# EAGLE design feedback-strobe (EAGLE 7.3.0)
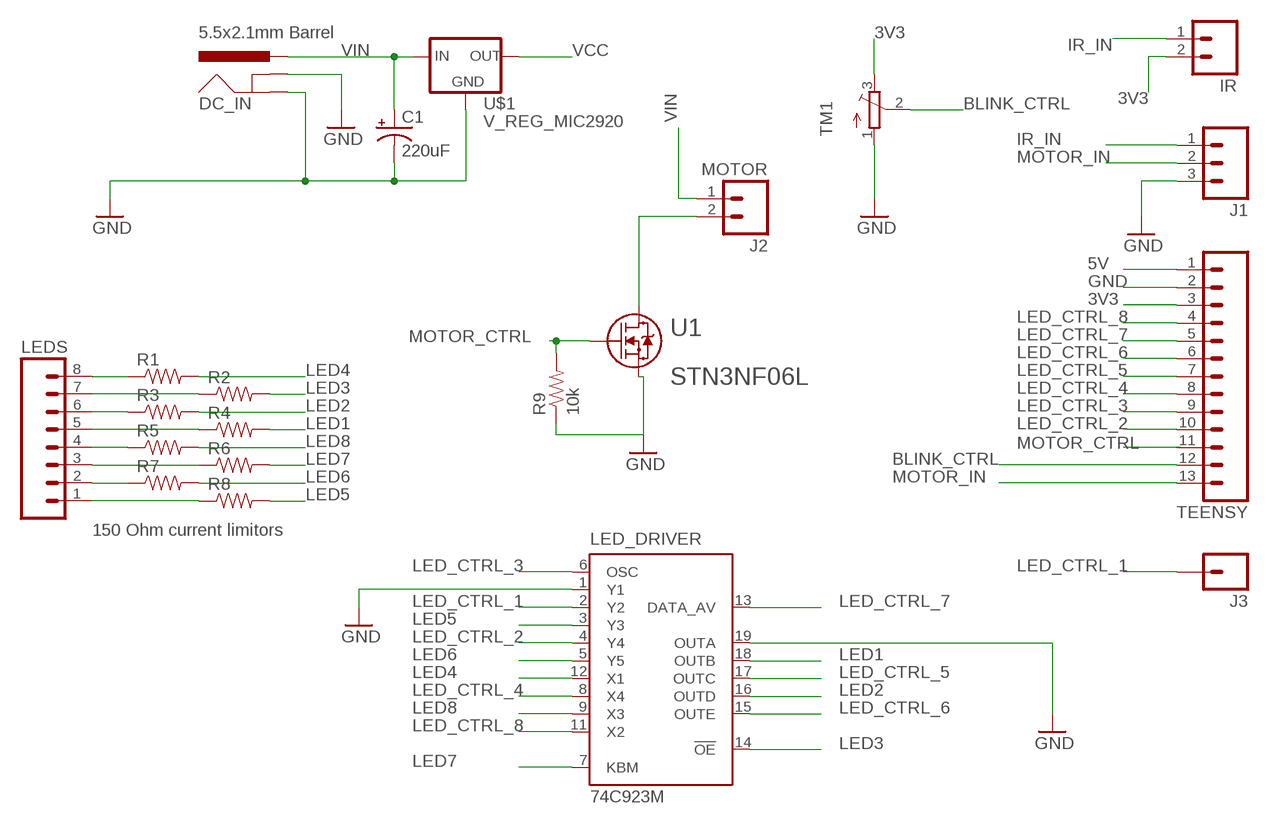
[diagram p0: schematic, sheet 1]

## Parts
C1  220uF  CAP_POLF80  [NIPPON_F80]
DC_IN  5.5x2.1mm Barrel  POWER_JACKSMD  [POWER_JACK_SMD]
IR  M02PTH  [1X02]
J1  M03PTH  [1X03]
J2  MOTOR  M02PTH  [1X02]
J3  M01PTH  [1X01]
LED_DRIVER  74C923M  [SO20W]
LEDS  M08  [1X08_ROUND]
R1  RESISTOR0603-RES  [0603-RES]
R2  RESISTOR0603-RES  [0603-RES]
R3  RESISTOR0603-RES  [0603-RES]
R4  RESISTOR0603-RES  [0603-RES]
R5  RESISTOR0603-RES  [0603-RES]
R6  RESISTOR0603-RES  [0603-RES]
R7  RESISTOR0603-RES  [0603-RES]
R8  RESISTOR0603-RES  [0603-RES]
R9  10k  RESISTOR0603-RES  [0603-RES]
TEENSY  M13  [1X13]
TM1  TRIMPOT3386  [TRIM-3386]
U1  STN3NF06L  [SOT-223]
U$1  V_REG_MIC2920  [SOT223]

## Nets
3V3: IR.2 TEENSY.3 TM1.3(E)
5V: TEENSY.1
BLINK_CTRL: TEENSY.12 TM1.2(S)
GND: C1.- DC_IN.GND(GNDBREAK) DC_IN.P$4(GND) J1.3 LED_DRIVER.1(Y1) LED_DRIVER.19(OUTA) R9.1 TEENSY.2 TM1.1(A) U1.3 U$1.2(GND)
IR_IN: IR.1 J1.1
LED1: LED_DRIVER.18(OUTB) R4.2
LED2: LED_DRIVER.16(OUTD) R3.2
LED3: LED_DRIVER.14(!OE) R2.2
LED4: LED_DRIVER.12(X1) R1.2
LED5: LED_DRIVER.3(Y3) R8.2
LED6: LED_DRIVER.5(Y5) R7.2
LED7: LED_DRIVER.7(KBM) R6.2
LED8: LED_DRIVER.9(X3) R5.2
LED_CTRL_1: J3.1 LED_DRIVER.2(Y2)
LED_CTRL_2: LED_DRIVER.4(Y4) TEENSY.10
LED_CTRL_3: LED_DRIVER.6(OSC) TEENSY.9
LED_CTRL_4: LED_DRIVER.8(X4) TEENSY.8
LED_CTRL_5: LED_DRIVER.17(OUTC) TEENSY.7
LED_CTRL_6: LED_DRIVER.15(OUTE) TEENSY.6
LED_CTRL_7: LED_DRIVER.13(DATA_AV) TEENSY.5
LED_CTRL_8: LED_DRIVER.11(X2) TEENSY.4
MOTOR_CTRL: R9.2 U1.1
MOTOR_IN: J1.2 TEENSY.13
N$1: LEDS.8 R1.1
N$3: LEDS.7 R2.1
N$5: LEDS.6 R3.1
N$7: J2.2 U1.2
N$12: LEDS.1 R8.1
N$13: LEDS.2 R7.1
N$16: LEDS.4 R5.1
N$17: LEDS.3 R6.1
N$18: LEDS.5 R4.1
VCC: U$1.3(OUT)
VIN: C1.+ DC_IN.VIN0(PWR) J2.1 U$1.1(IN)
Unconnected: TEENSY.11

## Notes on the sheet
- 150 Ohm current limitors

## Power pins joined to a net without a drawn wire
GND: LED_DRIVER.10(GND)
VCC: LED_DRIVER.20(VCC)

## Library data of the parts
C1 = SparkFun-Passives:CAP_POL: Capacitor Polarized These are standard SMD and PTH capacitors. Normally 10uF, 47uF, and 100uF in electrolytic and tantalum varieties. Always verify the external diameter of the through hole cap, it varies with capacity, voltage, and manufacturer. The EIA devices should be standard.
DC_IN = SparkFun-Connectors:POWER_JACK: Power Jack This is the standard 5.5mm barrel jack for power. The PTH is the most common, proven, reliable, footprint. The Slot footprint only works if the mill layer is transmitted to the PCB fab house so be warned. Mating wall wart : TOL-00298 (and others); PROD_ID: CONN-08106; SF_ID: PRT-12748
IR J2 = SparkFun-Connectors:M02: Standard 2-pin 0.1" header. Use with - straight break away headers ( PRT-00116) - right angle break away headers (PRT-00553) - swiss pins (PRT-00743) - machine pins (PRT-00117) - female headers (PRT-00115) Molex polarized connector foot print use with: PRT-08233 with associated crimp pins and housings. 2.54_SCREWTERM for use with PRT-10571. 3.5mm Screw Terminal footprints for PRT-08084 5mm Screw Terminal footprints for use with PRT-08432
J1 = SparkFun-Connectors:M03: Header 3 Standard 3-pin 0.1" header. Use with straight break away headers (SKU : PRT-00116), right angle break away headers (PRT-00553), swiss pins (PRT-00743), machine pins (PRT-00117), and female headers (PRT-00115). Molex polarized connector foot print use with SKU : PRT-08232 with associated crimp pins and housings.
J3 = SparkFun-Connectors:M01: Header 1 Standard 1-pin 0.1" header. Use with straight break away headers (SKU : PRT-00116), right angle break away headers (PRT-00553), swiss pins (PRT-00743), machine pins (PRT-00117), and female headers (PRT-00115). SMTSO-256-ET is a "flush mount" nut for a 4-40 screw. The older package used to be too tight, and did not allow it to sit properly thru the drill hit. The latest (0.165DIA) fits nice and snug.
LED_DRIVER = 74xx-us:74C923: 20-Key Encoder Source: http://www.national.com/ds/MM/MM54C922.pdf#page=1
LEDS = SparkFun-Connectors:M08: Header 8 Standard 8-pin 0.1" header. Use with straight break away headers (SKU : PRT-00116), right angle break away headers (PRT-00553), swiss pins (PRT-00743), machine pins (PRT-00117), and female headers (PRT-00115).; PROD_ID: CONN-08437
R1-R9 = SparkFun-Passives:RESISTOR: Resistor Basic schematic elements and footprints for 0603, 1206, and PTH resistors.
TEENSY = SparkFun-Connectors:M13: 13-pin single row .1" header
TM1 = adafruit:TRIMPOT: SMT trimmer potentiometer part number TC33X http://www.ladyada.net/library/eagle
U1 = n-fet:STN3NF06L; COPYRIGHT: Copyright C 2015 Accelerated Designs. All rights reserved; CURRENTCONTINUOUSDRAINID25C: 4A; DATASHEET: httpwww.st.cominternetcomTECHNICAL_RESOURCESTECHNICAL_LITERATUREDATASHEETCD00002430.pdf; DIGIKEYPARTNUMBER: 49731772ND; DRAINTOSOURCEVOLTAGEVDSS: 60V; FETFEATURE: Logic Level Gate; FETTYPE: MOSFET NChannel Metal Oxide; GATECHARGEQGVGS: 9nC 5V; INPUTCAPACITANCECISSVDS: 340pF 25V; MANUFACTURER_PART_NUMBER: STN3NF06L; MOUNTINGTYPE: Surface Mount; PACKAGECASE: TO2614 TO261AA; PACKAGING: Tape &amp Reel TR; POWERMAX: 3.3W; QUANTITY_AVAILABLE: 16000; RDSONMAXIDVGS: 100 mOhm 1.5A 10V; SUPPLIERDEVICEPACKAGE: SOT223; VENDOR: ST Microelectronics; VGSTHMAXID: 2.8V 250µA
U$1 = SparkFun-PowerIC:V_REG_MIC2920: MIC2920A (http://www.micrel.com/_PDF/mic2920.pdf) - 400mA output LDO Regulator

## Board
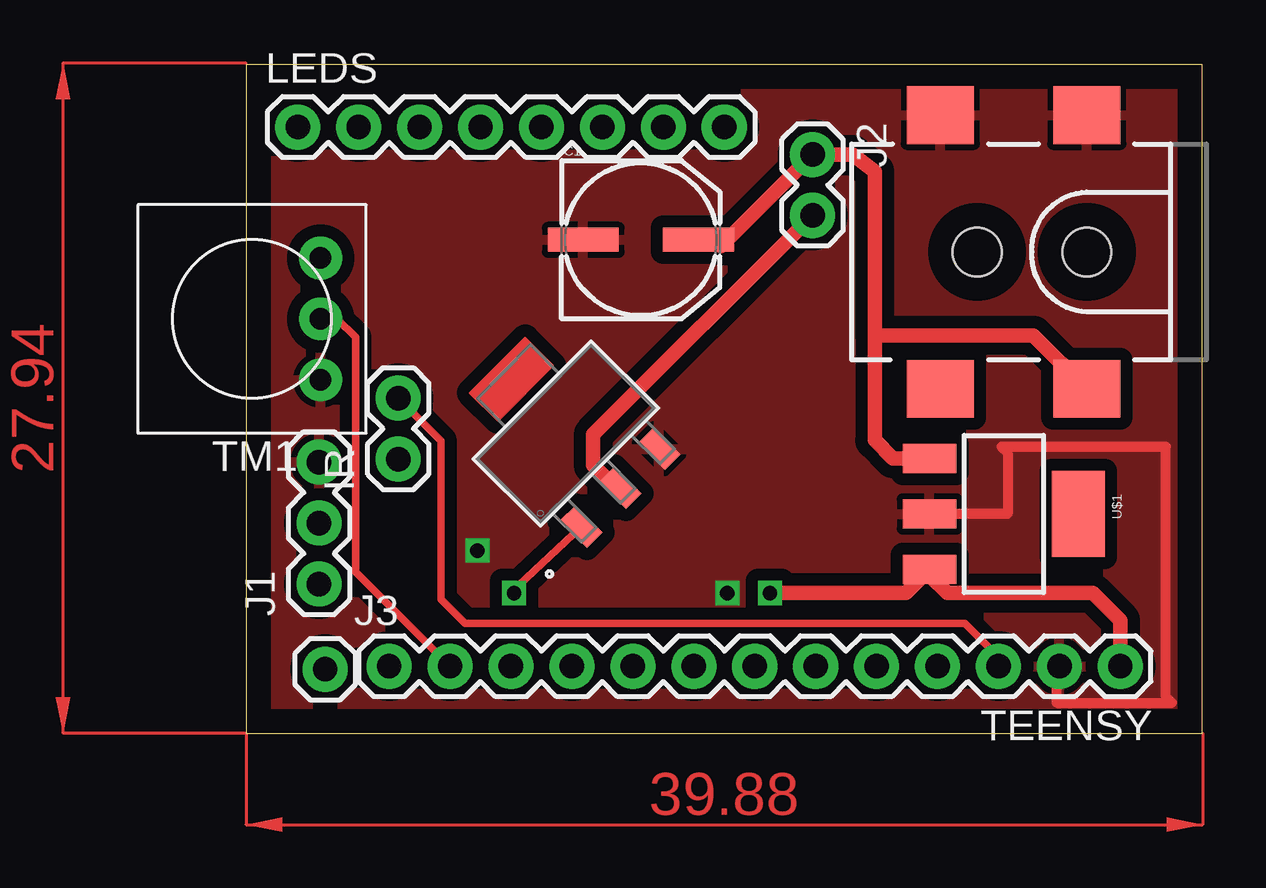
[diagram p1: board, top side]
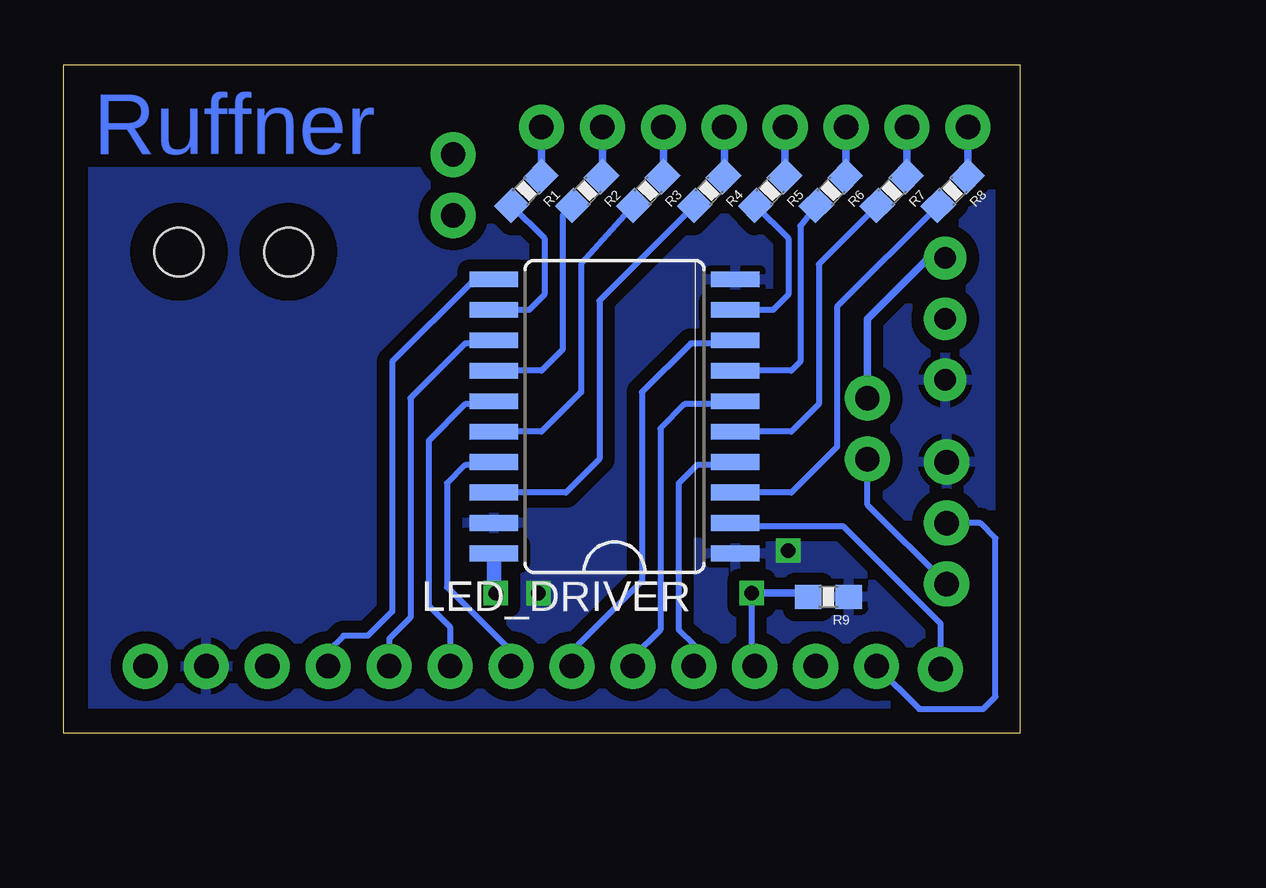
[diagram p2: board, bottom side, seen from below]

Size 39.86 x 27.86 mm. Coordinates in mm from the lower left corner, seen from the top.
Outline: 0,0 39.86,0 39.86,27.86 0,27.86 0,0
Copper layers (1*16): Top 0.035mm / dielectric 1.5mm / Bottom 0.035mm
Design rules "default": minimum track width 10mil, minimum drill 24mil, track to track 8mil, track to pad 8mil, pad to pad 8mil, via to via 8mil, smd to smd 8mil, copper to edge 40mil, drill to drill 8mil, minimum pad ring 10mil, minimum via ring 8mil, stop-mask expansion 4mil, vias tented up to drill 0mil, thermal gap 10mil

### Footprints (pad centres in the part's own frame; a part is rotated, then mirrored left to right if it is on the bottom)
NIPPON_F80 = smd 2.95 x 1: + 2.4,0; - -2.4,0
POWER_JACK_SMD = smd 2.8 x 2.4: GND 0,-5.7; P$4 6.1,-5.7; VIN0 0,5.7; VIN1 6.1,5.7 | hole 2.032: 0,0; 4.572,0
1X02 = drill 1.016 pad 1.88: 1 0,0; 2 2.54,0
1X03 = drill 1.016 pad 1.88: 1 0,0; 2 2.54,0; 3 5.08,0
1X01 = drill 1.016 pad 1.88: 1 0,0
SO20W = smd 0.66 x 2.032: 1 -5.715,-5.029; 2 -4.445,-5.029; 3 -3.175,-5.029; 4 -1.905,-5.029; 5 -0.635,-5.029; 6 0.635,-5.029; 7 1.905,-5.029; 8 3.175,-5.029; 9 4.445,-5.029; 10 5.715,-5.029; 11 5.715,5.029; 12 4.445,5.029; 13 3.175,5.029; 14 1.905,5.029; 15 0.635,5.029; 16 -0.635,5.029; 17 -1.905,5.029; 18 -3.175,5.029; 19 -4.445,5.029; 20 -5.715,5.029
1X08_ROUND = drill 1.016 pad 1.88: 1 0,0; 2 2.54,0; 3 5.08,0; 4 7.62,0; 5 10.16,0; 6 12.7,0; 7 15.24,0; 8 17.78,0
0603-RES = smd 1.1 x 1: 1 -0.85,0; 2 0.85,0
1X13 = drill 1.016 pad 1.88: 1 0,0; 2 2.54,0; 3 5.08,0; 4 7.62,0; 5 10.16,0; 6 12.7,0; 7 15.24,0; 8 17.78,0; 9 20.32,0; 10 22.86,0; 11 25.4,0; 12 27.94,0; 13 30.48,0
TRIM-3386 = drill 0.9 pad 1.778: 1 -2.54,-2.857; 2 0,-2.857; 3 2.54,-2.857
SOT-223 = smd 0.914 x 1.6: 1 -2.3,-3.2; 2 0,-3.2; 3 2.3,-3.2
SOT223 = smd 1.219 x 2.235: 1 -2.311,-3.099; 2 0,-3.099; 3 2.311,-3.099 | smd 3.6 x 2.2: 4 0,3.099

### Placement (x,y rotation side)
C1  16.46,20.57 0 top
DC_IN  35.05,20.07 180 top
IR  6.35,11.43 90 top
J1  3.05,6.22 90 top
J2  23.62,24.13 270 top
J3  3.3,2.67 0 top
LED_DRIVER  16.89,13.21 90 bottom
LEDS  2.16,25.27 0 top
R1  20.57,22.61 225 bottom
R2  18.03,22.61 225 bottom
R3  15.49,22.61 225 bottom
R4  12.95,22.61 225 bottom
R5  10.41,22.61 225 bottom
R6  7.87,22.61 225 bottom
R7  5.33,22.61 225 bottom
R8  2.79,22.61 225 bottom
R9  7.98,5.69 180 bottom
TEENSY  36.45,2.79 180 top
TM1  0.25,17.27 90 top
U1  13.34,12.5 45 top
U$1  31.6,9.14 270 top

### Tracks (layer width: path | path; a pad name or v marks a point on that pad's centre or on a via)
3V3
  Top 0.305: IR.2 8.13,12.19 8.13,5.59 9.14,4.57 29.97,4.57 31.37,3.17 TEENSY.3
  Bottom 0.305: IR.2 6.35,17.27 3.81,19.81 TM1.3
5V
  Top 0.61: TEENSY.1 36.45,4.7 35.31,5.84 29.24,5.84 28.5,6.58
BLINK_CTRL
  Top 0.305: TEENSY.12 4.57,6.73 4.57,16.51 3.81,17.27 TM1.2
GND  (via drill 0.6)
  Top 0.406: TEENSY.2 33.78,2.67 33.78,1.27 38.61,1.27 38.35,1.52 38.35,11.94 31.5,11.94 31.75,11.68 31.75,9.14 U$1.2
  other vias: 20.07,5.84 9.65,7.62
  pour Top (isolate 0.508): 0,27.94 0,0 39.88,0 39.88,27.94
  pour Bottom (isolate 0.508): 0,0 0,27.81 39.88,27.81 39.88,0
IR_IN
  Bottom 0.254: J1.1 6.35,9.53 IR.1
LED1
  Bottom 0.254: R4.2 17.53,18.03 17.53,11.43 18.92,10.03 LED_DRIVER.18
LED2
  Bottom 0.254: R3.2 18.29,19.56 18.29,14.22 19.94,12.57 LED_DRIVER.16
LED3
  Bottom 0.254: R2.2 19.05,21.59 19.05,16 19.94,15.11 LED_DRIVER.14
LED4
  Bottom 0.254: R1.2 19.81,20.64 19.81,18.29 20.45,17.65 LED_DRIVER.12
LED5
  Bottom 0.254: R8.2 7.62,17.78 7.62,11.94 9.53,10.03 LED_DRIVER.3
LED6
  Bottom 0.254: R7.2 8.38,19.56 8.38,13.72 9.53,12.57 LED_DRIVER.5
LED7
  Bottom 0.254: R6.2 9.14,21.15 9.14,15.49 9.53,15.11 LED_DRIVER.7
LED8
  Bottom 0.254: R5.2 9.65,20.64 9.65,18.29 10.29,17.65 LED_DRIVER.9
LED_CTRL_1
  Bottom 0.254: LED_DRIVER.2 11.73,8.64 7.37,8.64 3.3,4.57 J3.1
LED_CTRL_2
  Bottom 0.254: LED_DRIVER.4 11.99,11.18 13.46,11.18 14.22,10.41 14.22,4.32 13.59,3.68 TEENSY.10
LED_CTRL_3
  Bottom 0.254: LED_DRIVER.6 11.99,13.72 13.97,13.72 14.99,12.7 14.99,4.32 16.13,3.17 TEENSY.9
LED_CTRL_4
  Bottom 0.254: LED_DRIVER.8 11.99,16.26 13.72,16.26 15.75,14.22 15.75,6.35 18.67,3.43 TEENSY.8
LED_CTRL_5
  Bottom 0.254: LED_DRIVER.17 22.05,11.18 23.11,11.18 23.88,10.41 23.88,6.1 21.21,3.43 TEENSY.7
LED_CTRL_6
  Bottom 0.254: LED_DRIVER.15 22.05,13.72 23.11,13.72 24.64,12.19 24.64,5.33 23.75,4.45 TEENSY.6
LED_CTRL_7
  Bottom 0.254: LED_DRIVER.13 22.05,16.26 23.11,16.26 25.4,13.97 25.4,4.83 26.29,3.94 TEENSY.5
LED_CTRL_8
  Bottom 0.254: LED_DRIVER.11 22.05,18.8 22.86,18.8 26.16,15.49 26.16,5.08 27.18,4.06 28.19,4.06 28.83,3.43 TEENSY.4
MOTOR_CTRL  (via drill 0.6)
  Top 0.305: v11.18,5.84 11.04,5.84 U1.1
  Bottom 0.254: v11.18,5.84 11.18,2.79
  Bottom 0.305: R9.2 8.98,5.84 v11.18,5.84
MOTOR_IN
  Bottom 0.254: TEENSY.13 4.19,1.02 1.52,1.02 1.02,1.52 1.02,8.13 1.65,8.76 J1.2
N$1
  Bottom 0.305: R1.1 19.94,23.24 LEDS.8
N$3
  Bottom 0.305: R2.1 17.4,23.24 LEDS.7
N$5
  Bottom 0.305: R3.1 14.86,23.24 LEDS.6
N$7
  Top 0.61: J2.2 14.48,12.45 14.48,11.18 15.42,10.23 U1.2
N$12
  Bottom 0.305: R8.1 2.16,23.24 LEDS.1
N$13
  Bottom 0.305: R7.1 4.7,23.24 LEDS.2
N$16
  Bottom 0.305: R5.1 9.78,23.24 LEDS.4
N$17
  Bottom 0.305: R6.1 7.24,23.24 LEDS.3
N$18
  Bottom 0.305: R4.1 12.32,23.24 LEDS.5
VCC  (via drill 0.6)
  Top 0.61: U$1.3 27.51,5.84 v21.84,5.84
  Bottom 0.61: v21.84,5.84 21.92,5.92 LED_DRIVER.20
VIN
  Top 0.61: DC_IN.VIN0 32.83,16.59 26.21,16.59 | 26.21,16.59 26.21,23.42 25.3,24.13 J2.1 19.81,20.32 C1.+ | 26.21,16.59 26.21,12.22 26.98,11.46 U$1.1
(copper drawn outside any net)
  shapes: Top area x2

### Text on the board
Bottom: Ruffner